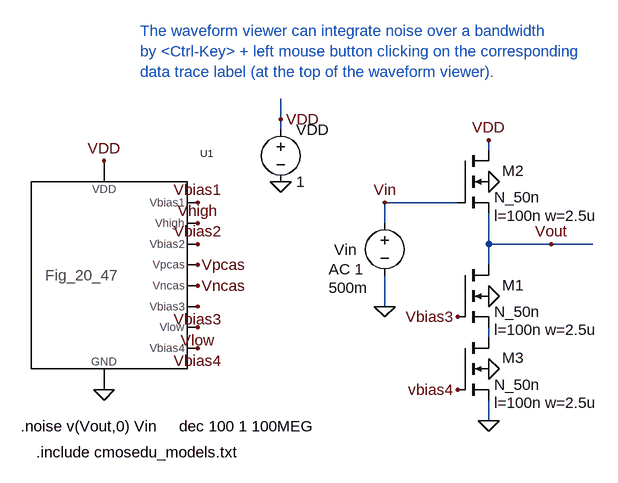
[diagram p0: schematic NOISE_Fig21_44.asc]
NOISE_Fig21_44.asc, the LTspice schematic file:
Version 4
SHEET 1 1784 680
WIRE 1072 -304 1072 -336
WIRE 1072 -288 1072 -304
WIRE 1392 -256 1392 -272
WIRE 1344 -176 1232 -176
WIRE 1232 -144 1232 -176
WIRE 1392 -112 1392 -160
WIRE 1488 -112 1392 -112
WIRE 1552 -112 1488 -112
WIRE 1392 -80 1392 -112
WIRE 1232 -16 1232 -64
WIRE 1392 32 1392 16
WIRE 1392 160 1392 128
FLAG 1072 -208 0
FLAG 1072 -304 VDD
FLAG 1392 -32 0
FLAG 1392 160 0
FLAG 1392 -272 VDD
FLAG 800 -240 VDD
FLAG 800 112 0
FLAG 944 -176 Vbias1
FLAG 944 -144 Vhigh
FLAG 944 -112 Vbias2
FLAG 944 -16 Vbias3
FLAG 944 -80 Vpcas
FLAG 944 -48 Vncas
FLAG 944 48 Vbias4
FLAG 944 16 Vlow
FLAG 1488 -112 Vout
FLAG 1232 -16 0
FLAG 1232 -176 Vin
FLAG 1392 -208 0
FLAG 1392 80 0
FLAG 1344 112 vbias4
FLAG 1344 0 Vbias3
SYMBOL voltage 1072 -304 R0
WINDOW 123 0 0 Left 0
WINDOW 39 0 0 Left 0
SYMATTR InstName VDD
SYMATTR Value 1
SYMBOL nmos4 1344 -80 R0
WINDOW 123 56 100 Left 0
WINDOW 0 69 31 Left 0
SYMATTR Value2 l=100n w=2.5u
SYMATTR InstName M1
SYMATTR Value N_50n
SYMBOL voltage 1232 -160 R0
WINDOW 123 -86 87 Left 0
WINDOW 39 0 0 Left 0
WINDOW 3 -86 115 Left 0
WINDOW 0 -78 57 Left 0
SYMATTR Value2 AC 1
SYMATTR Value 500m
SYMATTR InstName Vin
SYMBOL Fig_20_47 800 -64 R0
SYMATTR InstName U1
SYMBOL nmos4 1344 -256 R0
WINDOW 123 56 100 Left 0
WINDOW 0 69 31 Left 0
SYMATTR Value2 l=100n w=2.5u
SYMATTR InstName M2
SYMATTR Value N_50n
SYMBOL nmos4 1344 32 R0
WINDOW 123 56 100 Left 0
WINDOW 0 69 31 Left 0
SYMATTR Value2 l=100n w=2.5u
SYMATTR InstName M3
SYMATTR Value N_50n
TEXT 696 208 Left 0 !.include cmosedu_models.txt
TEXT 672 168 Left 0 !.noise v(Vout,0) Vin 	dec 100 1 100MEG
TEXT 856 -440 Left 0 ;The waveform viewer can integrate noise over a bandwidth \nby <Ctrl-Key> + left mouse button clicking on the corresponding \ndata trace label (at the top of the waveform viewer).

The netlist it stands for:
* NOISE_Fig21_44.asc
VDD VDD 0 1
M1 Vout Vbias3 N001 0 N_50n l=100n w=2.5u
Vin Vin 0 500m AC 1
XU1 Vbias1 Vhigh Vbias2 Vpcas Vncas Vbias3 Vlow Vbias4 VDD 0 Fig_20_47  ; pins Vbias1 Vhigh Vbias2 Vpcas Vncas Vbias3 Vlow Vbias4 VDD GND
M2 VDD Vin Vout 0 N_50n l=100n w=2.5u
M3 N001 Vbias4 0 0 N_50n l=100n w=2.5u
.model NMOS NMOS
.model PMOS PMOS
.lib standard.mos
.include cmosedu_models.txt
.noise v(Vout,0) Vin 	dec 100 1 100MEG
* The waveform viewer can integrate noise over a bandwidth
* by <Ctrl-Key> + left mouse button clicking on the corresponding
* data trace label (at the top of the waveform viewer).
.backanno
.end